# Altium schematic sheet keyInput.SchDoc: KeyInput Subsystem
size Letter; DrawnBy: Senuri Ranatunga; SheetNumber: 1; SheetTotal: 1
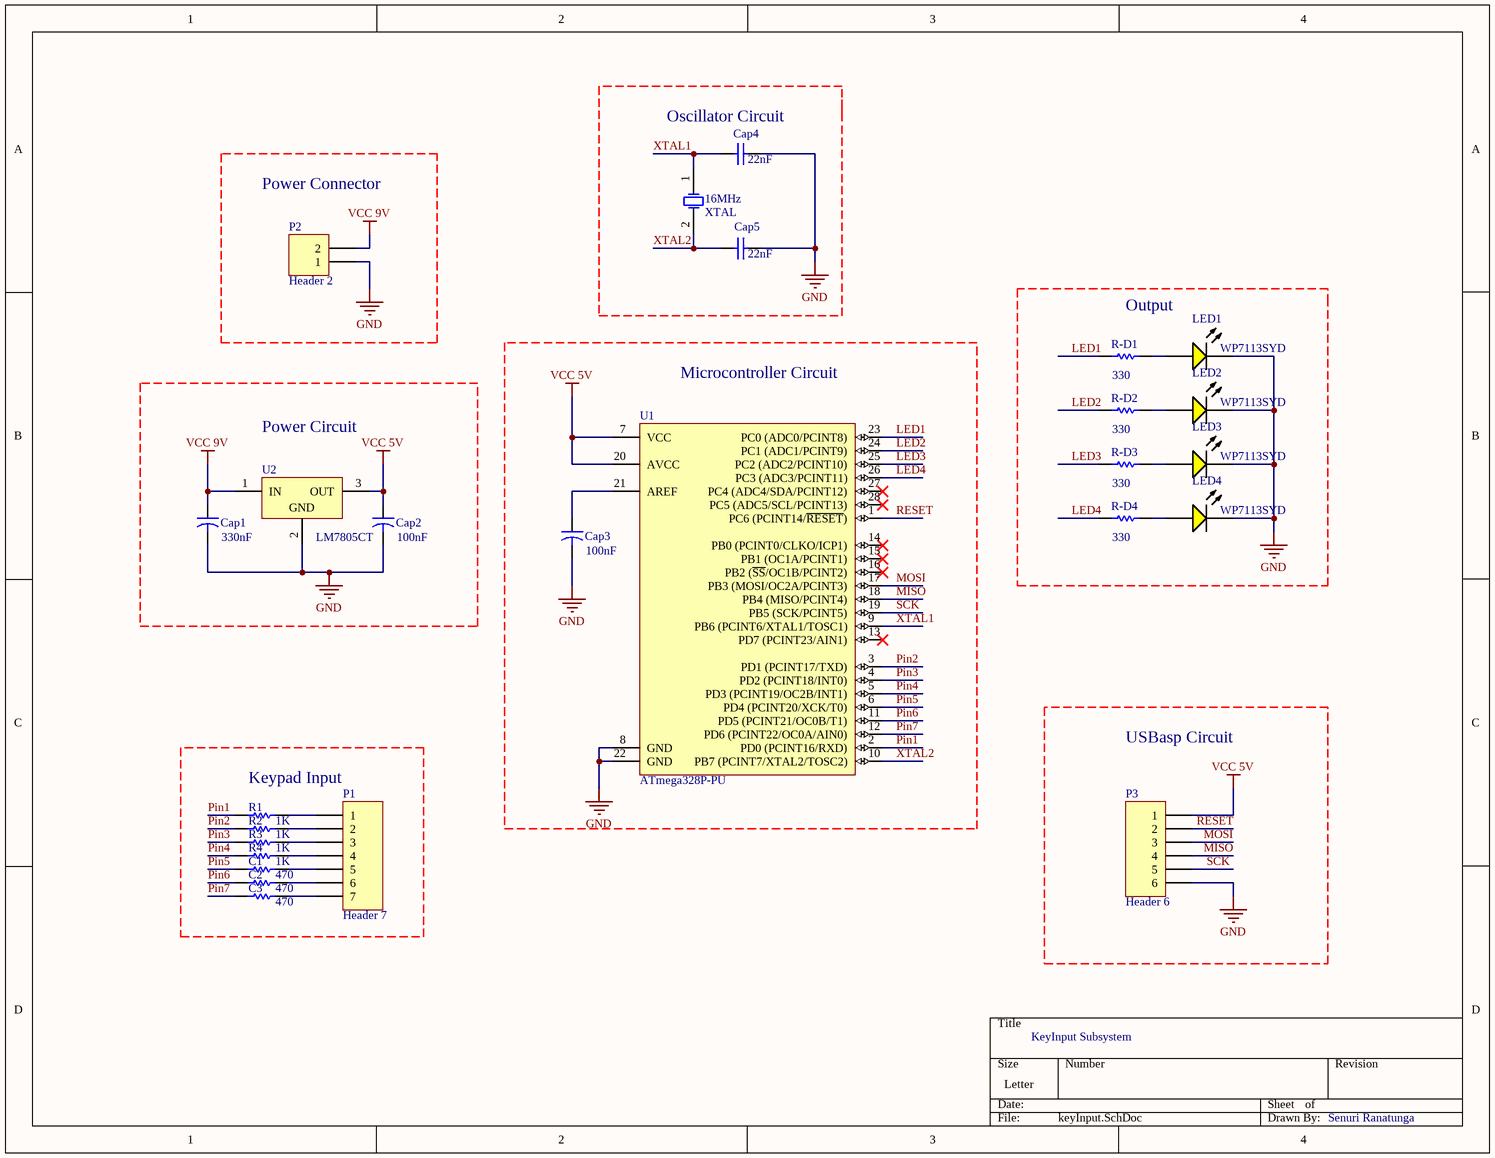
[diagram p0: keyInput.SchDoc]

## Parts
16MHz  XTAL  [R38]
C1  470  [AXIAL-0.3]
C2  470  [AXIAL-0.3]
C3  470  [AXIAL-0.3]
Cap1  330nF  [CAPR5-4X5]
Cap2  100nF  [CAPR5-4X5]
Cap3  100nF  [CAPR5-4X5]
Cap4  22nF  [RAD-0.3]
Cap5  22nF  [RAD-0.3]
LED1  WP7113SYD  [KING-WP7113SYD_V]
LED2  WP7113SYD  [KING-WP7113SYD_V]
LED3  WP7113SYD  [KING-WP7113SYD_V]
LED4  WP7113SYD  [KING-WP7113SYD_V]
P1  Header 7  [HDR1X7]
P2  Header 2  [HDR1X2]
P3  Header 6  [HDR1X6]
R1  1K  [AXIAL-0.3]
R2  1K  [AXIAL-0.3]
R3  1K  [AXIAL-0.3]
R4  1K  [AXIAL-0.3]
R-D1  330  [AXIAL-0.3]
R-D2  330  [AXIAL-0.3]
R-D3  330  [AXIAL-0.3]
R-D4  330  [AXIAL-0.3]
U1  ATmega328P-PU  [28P3]
U2  LM7805CT  [FAIR-TO-220-3]

## Blocks framed on the sheet
Oscillator Circuit: 16MHz Cap4 Cap5
Power Connector: P2
Output: LED1-LED4 R-D1-R-D4
Microcontroller Circuit: Cap3 U1
Power Circuit: Cap1 Cap2 U2
Keypad Input: C1-C3 P1 R1-R4
USBasp Circuit: P3

## Nets
GND: Cap1.2 Cap2.2 Cap3.2 Cap4.2 Cap5.2 LED1.2(K) LED2.2(K) LED3.2(K) LED4.2(K) P2.1 P3.6 U1.8(GND) U1.22(GND) U2.2(GND)
VCC 5V: Cap2.1 P3.1 U1.7(VCC) U1.20(AVCC) U2.3(OUT)
VCC 9V: Cap1.1 P2.2 U2.1(IN)
LED1: R-D1.1 U1.23(PC0_(ADC0/PCINT8))
LED2: R-D2.1 U1.24(PC1_(ADC1/PCINT9))
LED3: R-D3.1 U1.25(PC2_(ADC2/PCINT10))
LED4: R-D4.1 U1.26(PC3_(ADC3/PCINT11))
MISO: P3.4 U1.18(PB4_(MISO/PCINT4))
MOSI: P3.3 U1.17(PB3_(MOSI/OC2A/PCINT3))
Pin1: R1.2 U1.2(PD0_(PCINT16/RXD))
Pin2: R2.1 U1.3(PD1_(PCINT17/TXD))
Pin3: R3.1 U1.4(PD2_(PCINT18/INT0))
Pin4: R4.2 U1.5(PD3_(PCINT19/OC2B/INT1))
Pin5: C1.1 U1.6(PD4_(PCINT20/XCK/T0))
Pin6: C2.1 U1.11(PD5_(PCINT21/OC0B/T1))
Pin7: C3.1 U1.12(PD6_(PCINT22/OC0A/AIN0))
RESET: P3.2 U1.1(PC6_(PCINT14/~{RESET}))
SCK: P3.5 U1.19(PB5_(SCK/PCINT5))
XTAL1: 16MHz.1(OSC1) Cap4.1 U1.9(PB6_(PCINT6/XTAL1/TOSC1))
XTAL2: 16MHz.2(OSC2) Cap5.1 U1.10(PB7_(PCINT7/XTAL2/TOSC2))
NetC1_2: C1.2 P1.5
NetC2_2: C2.2 P1.6
NetC3_2: C3.2 P1.7
NetCap3_1: Cap3.1 U1.21(AREF)
NetLED1_1: LED1.1(A) R-D1.2
NetLED2_1: LED2.1(A) R-D2.2
NetLED3_1: LED3.1(A) R-D3.2
NetLED4_1: LED4.1(A) R-D4.2
NetP1_1: P1.1 R1.1
NetP1_2: P1.2 R2.2
NetP1_3: P1.3 R3.2
NetP1_4: P1.4 R4.1

Not connected (* = marked no-connect by the designer): U1 13(PD7_(PCINT23/AIN1))* 14(PB0_(PCINT0/CLKO/ICP1))* 15(PB1_(OC1A/PCINT1))* 16(PB2_(~{SS}/OC1B/PCINT2))* 27(PC4_(ADC4/SDA/PCINT12))* 28(PC5_(ADC5/SCL/PCINT13))*

## Library data of the parts
16MHz = XTAL: Crystal Oscillator; Published: 8-Jun-2000; LatestRevisionDate: 17-Jul-2002; LatestRevisionNote: Re-released for DXP Platform.; PackageReference: R38; Publisher: Altium Limited; PackageDescription: Crystal, Thru-Hole; 2 Leads; Body 3.1 x 8.2 mm (Dia.xH)
C1-C3 R1-R4 R-D1-R-D4 = Res1: Resistor; Published: 8-Jun-2000; LatestRevisionDate: 17-Jul-2002; LatestRevisionNote: Re-released for DXP Platform.; PackageReference: AXIAL-0.3; Publisher: Altium Limited; PackageDescription: Axial Device, Thru-Hole; 2 Leads; 0.3 in Pin Spacing
  C1-C3: Value: 470
  R1-R4: Value: 1K
  R-D1-R-D4: Value: 330
Cap1-Cap3 = Cap2: Capacitor; Published: 23-Sep-2002; PackageReference: CAPR5-4X5; Publisher: Altium Limited; PackageDescription: Capacitor; 2 Leads
  Cap1: Value: 330nF
  Cap2 Cap3: Value: 100nF
Cap4 Cap5 = Cap: Capacitor; Published: 8-Jun-2000; LatestRevisionDate: 17-Jul-2002; LatestRevisionNote: Re-released for DXP Platform.; PackageReference: RAD-0.3; Publisher: Altium Limited; PackageDescription: Radial Cap, Thru-Hole; 2 Leads; 0.3 in Pin Spacing; Value: 22nF
LED1-LED4 = CMP-1757-00003-1: The Super Bright Yellow Device, 2 V, -40 to 85 degC, 2-Pin THD, RoHS, Tape and Reel; Tolerance: 1%; Power Rating: 250 mW; Voltage Rating: 250 V; Resistance: 22.1 kohm; Case\Package: Axial; Length: 0.248 inch; Max Operating Temperature: 155 degC; PackageDescription: 2-Pin Through Hole Device, Dia 5.9 mm, Body Length 8.6 mm; Package Quantity: 200; ComponentLink1Description: Datasheet; Mount: Through Hole; DatasheetVersion: Rev. 7B, 01/2015; RoHSCompliant: true; PackageReference: WP7113SYD; ComponentLink1URL: http://www.kingbrightusa.com/images/catalog/SPEC/WP7113SYD.pdf; Packaging: Bulk; Min Operating Temperature: -55 degC
P1 = Header 7: Header, 7-Pin; LatestRevisionDate: 17-Jul-2002; LatestRevisionNote: Re-released for DXP Platform.; Publisher: Altium Limited
P2 = Header 2: Header, 2-Pin; LatestRevisionDate: 17-Jul-2002; LatestRevisionNote: Re-released for DXP Platform.; Publisher: Altium Limited
P3 = Header 6: Header, 6-Pin; LatestRevisionDate: 17-Jul-2002; LatestRevisionNote: Re-released for DXP Platform.; Publisher: Altium Limited
U1 = CMP-0095-00013-2: 8-bit AVR Microcontroller, 32KB Flash, 1KB EEPROM, 2KB SRAM, 28-pin PDIP, Industrial Grade (-40°C to 85°C); RevisionNote: DatasheetVersion updated. URLs added.; PackageVersion: revB, Sep-2001; PackageDescription: 28-lead (0.300"/7.62mm Wide) Plastic Dual Inline Package (PDIP); DatasheetVersion: revD, May-2011; ComponentLink1Description: Manufacturer URL; ComponentLink1URL: http://www.atmel.com/; PackageReference: 28P3; ComponentLink2Description: ATmega48A/48PA/88A/88PA/168A/168PA/328/328P Datasheet; ComponentLink3URL: http://www.atmel.com/dyn/resources/prod_documents/8271S.pdf; ComponentLink2URL: http://www.atmel.com/dyn/resources/prod_documents/8271.pdf; ComponentLink3Description: ATmega48A/48PA/88A/88PA/168A/168PA/328/328P Summary
U2 = CMP-2000-04938-1: Positive Voltage Regulator, 5 V, 1 A, -40 to 125 degC, 3-Pin TO-220, RoHS, Tube; Manufacturer: FairchildSemiconductor; Maximum Input Voltage: 35V; Maximum Quiescent Current: 8mA; Load Regulation: 100mV; Maximum Output Current: 2.2(Typ)A; Output Type: Fixed; Typical Dropout Voltage @ Current: 2@1AV; Rad Hard: No; Output Voltage: 5V; Accuracy: ±4%; Number of Outputs: 1; Category: LinearRegulator; Package Description: 3-Pin Through Hole Device, Body 10 x 4.5 mm, Pitch 2.54 mm; Packaging: Rail/Tube; Mounting: ThroughHole; Polarity: Positive; Manufacturer URL: https://www.fairchildsemi.com/; Line Regulation: 100mV; Datasheet Version: Aug-12; Datasheet URL: https://datasheet.ciiva.com/26904/lm7805ct-26904988.pdf; Package Reference: TO-220; Package URL: https://www.fairchildsemi.com/package-drawings/TO/TO220B03.pdf; Package: 3TO-220AB; Operating Temperature: -40to125degC; Type: Linear